# EAGLE schematic blink1mk3_card2 (EAGLE 9.0.1)
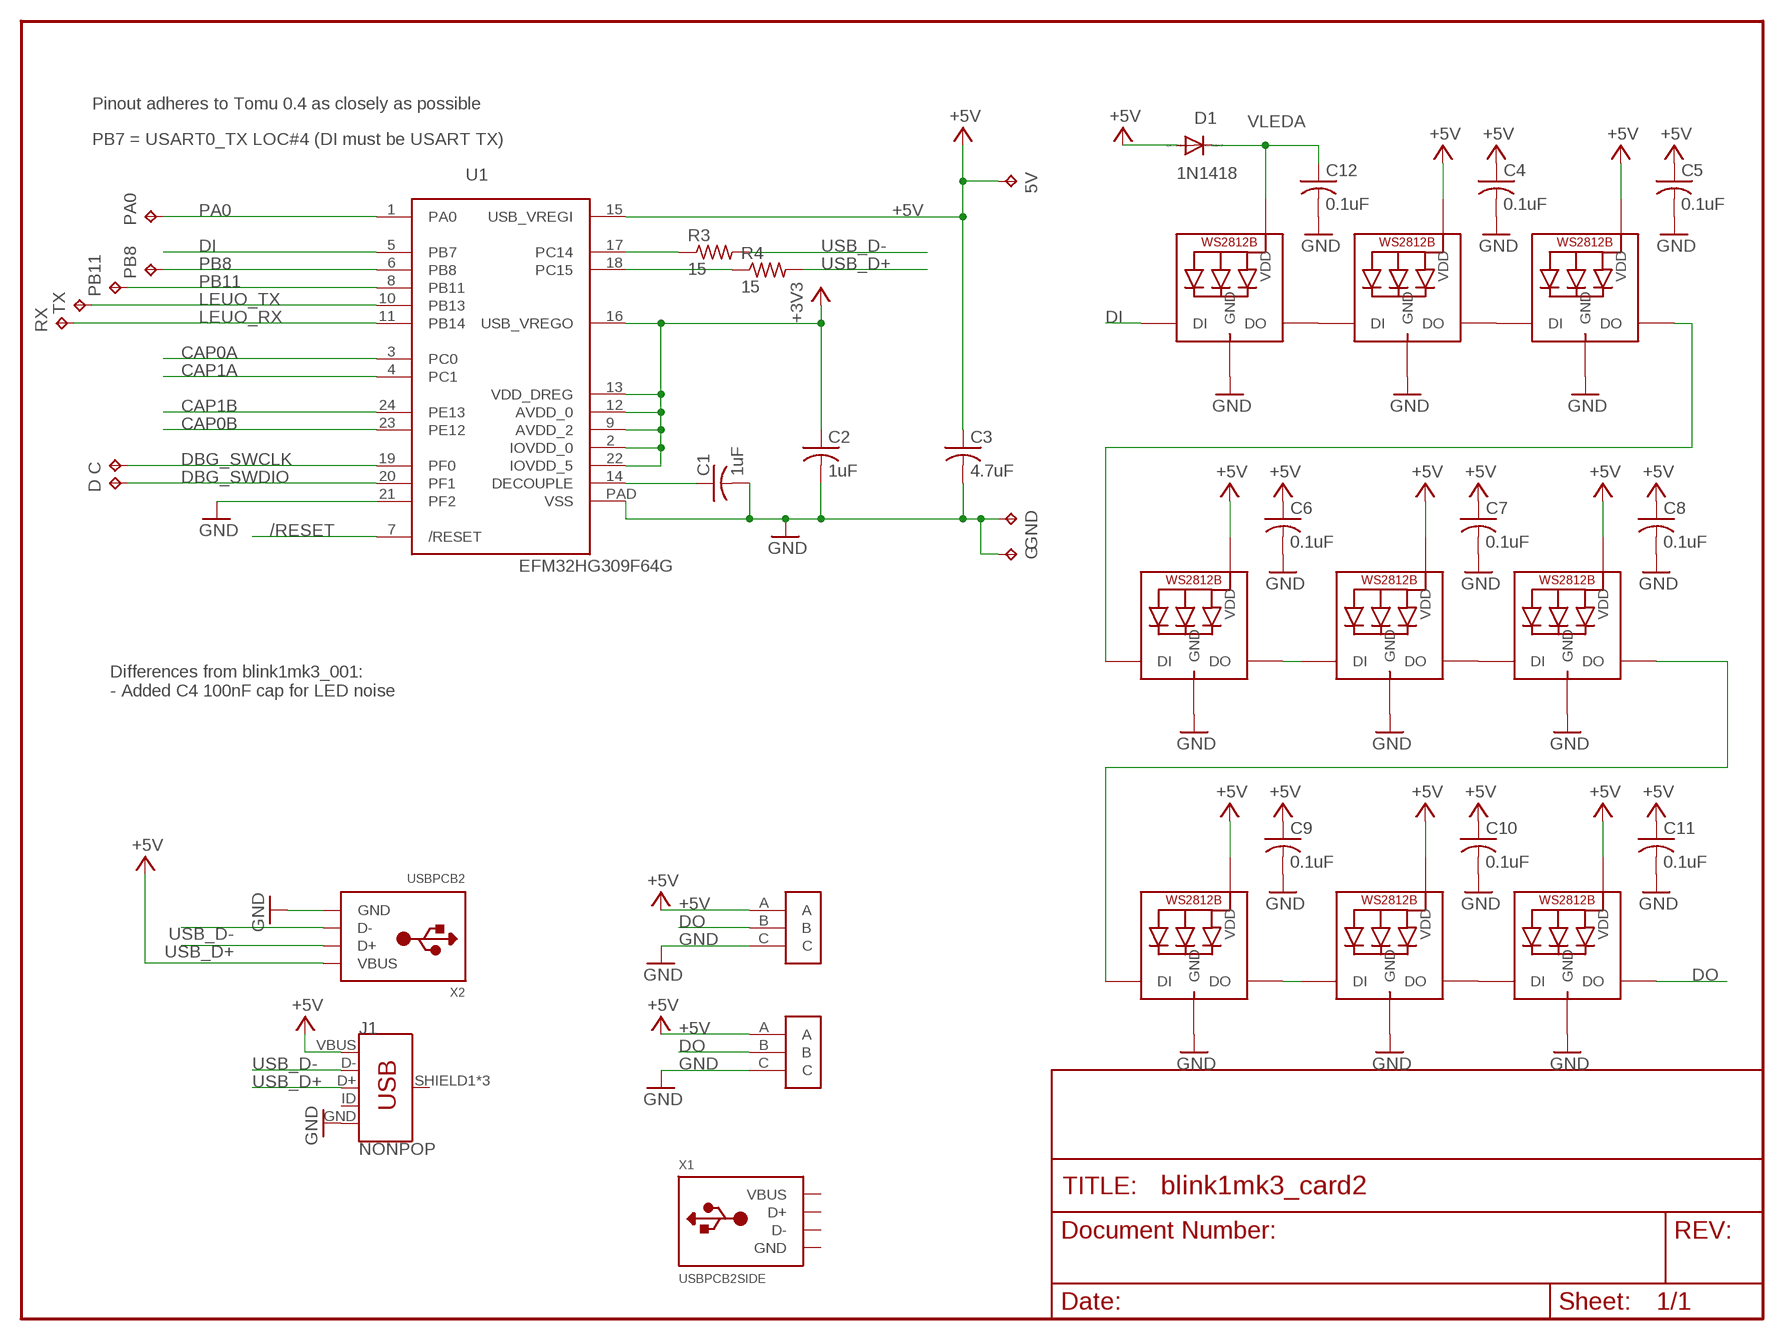
[diagram p0: schematic, sheet 1]

## Parts
5V  TPTP15R  [TP15R]
C  TPTP15R  [TP15R]
C1  1uF  C-USC0603  [C0603]
C2  1uF  C-USC0603  [C0603]
C3  4.7uF  C-USC0603  [C0603]
C4  0.1uF  C-USC0603  [C0603]
C5  0.1uF  C-USC0603  [C0603]
C6  0.1uF  C-USC0603  [C0603]
C7  0.1uF  C-USC0603  [C0603]
C8  0.1uF  C-USC0603  [C0603]
C9  0.1uF  C-USC0603  [C0603]
C10  0.1uF  C-USC0603  [C0603]
C11  0.1uF  C-USC0603  [C0603]
C12  0.1uF  C-USC0603  [C0603]
D  TPTP15R  [TP15R]
D1  1N1418  DIODE-SOD523  [SOD523]
G  TPTP14SQ  [TP14SQ]
GND  TPTP14SQ  [TP14SQ]
J1  NONPOP  USB_MICRO-B_FEMALE-SMT  [USB-B-MICRO-SMD]
LED1  SK6812MINI  WS2812B3535  [LED3535]
LED2  SK6812MINI  WS2812B3535  [LED3535]
LED3  SK6812MINI  WS2812B3535  [LED3535]
LED4  SK6812MINI  WS2812B3535  [LED3535]
LED5  SK6812MINI  WS2812B3535  [LED3535]
LED6  SK6812MINI  WS2812B3535  [LED3535]
LED7  SK6812MINI  WS2812B3535  [LED3535]
LED8  SK6812MINI  WS2812B3535  [LED3535]
LED9  SK6812MINI  WS2812B3535  [LED3535]
PA0  TPTP15R  [TP15R]
PB8  TPTP15R  [TP15R]
PB11  TPTP15R  [TP15R]
R3  15  R-US_R0603  [R0603]
R4  15  R-US_R0603  [R0603]
RX  TPTP15R  [TP15R]
TX  TPTP15R  [TP15R]
U1  EFM32HG309F64G  [QFN24PAD]
U$1  LED_STRIP_3P  [LEDSTRIP-3P]
U$2  LED_STRIP_3P  [LEDSTRIP-3P]
X1  USBPCB2SIDE  [USB-A-PCB-TWOSIDED]
X2  USBPCB2  [USB-A-PCB-2]

## Nets
+3V3: C2.1 U1.2(IOVDD_0) U1.9(AVDD_2) U1.12(AVDD_0) U1.13(VDD_DREG) U1.16(USB_VREGO) U1.22(IOVDD_5)
+5V: 5V.TP C3.1 C4.1 C5.1 C6.1 C7.1 C8.1 C9.1 C10.1 C11.1 D1.A J1.VBUS LED2.2(VDD) LED3.2(VDD) LED4.2(VDD) LED5.2(VDD) LED6.2(VDD) LED7.2(VDD) LED8.2(VDD) LED9.2(VDD) U1.15(USB_VREGI) U$1.A U$2.A X2.5V(VBUS)
/RESET: U1.7(/RESET)
CAP0A: U1.3(PC0)
CAP0B: U1.23(PE12)
CAP1A: U1.4(PC1)
CAP1B: U1.24(PE13)
DBG_SWCLK: C.TP U1.19(PF0)
DBG_SWDIO: D.TP U1.20(PF1)
DECOUPLE: C1.1 U1.14(DECOUPLE)
DI: LED1.1(DI) U1.5(PB7)
DO: LED9.3(DO) U$1.B U$2.B
GND: C1.2 C2.2 C3.2 C4.2 C5.2 C6.2 C7.2 C8.2 C9.2 C10.2 C11.2 C12.2 G.TP GND.TP J1.GND LED1.4(GND) LED2.4(GND) LED3.4(GND) LED4.4(GND) LED5.4(GND) LED6.4(GND) LED7.4(GND) LED8.4(GND) LED9.4(GND) U1.21(PF2) U1.PAD(VSS) U$1.C U$2.C X2.GND
LEUO_RX: RX.TP U1.11(PB14)
LEUO_TX: TX.TP U1.10(PB13)
N$2: LED1.3(DO) LED2.1(DI)
N$4: LED7.3(DO) LED8.1(DI)
N$5: LED4.3(DO) LED5.1(DI)
N$6: LED5.3(DO) LED6.1(DI)
N$7: LED2.3(DO) LED3.1(DI)
N$8: LED3.3(DO) LED4.1(DI)
N$9: LED8.3(DO) LED9.1(DI)
N$10: LED6.3(DO) LED7.1(DI)
PA0: PA0.TP U1.1(PA0)
PB8: PB8.TP U1.6(PB8)
PB11: PB11.TP U1.8(PB11)
RUSB_D+: R4.1 U1.18(PC15)
RUSB_D-: R3.1 U1.17(PC14)
USB_D+: J1.D+ R4.2 X2.USB_P(D+)
USB_D-: J1.D- R3.2 X2.USB_M(D-)
VLEDA: C12.1 D1.C LED1.2(VDD)
Unconnected: J1.ID J1.SHIELD1(SHIELD) J1.SHIELD2(SHIELD) J1.SHIELD3(SHIELD) X1.USB_M@1(D-) X1.USB_M@2(D-) X1.USB_M@3(D-) X1.USB_P@1(D+) X1.USB_P@2(D+) X1.USB_P@3(D+)

## Notes on the sheet
- Pinout adheres to Tomu 0.4 as closely as possible
- PB7 = USART0_TX LOC#4 (DI must be USART TX)
- Differences from blink1mk3_001:
  - Added C4 100nF cap for LED noise

## Power pins joined to a net without a drawn wire
GND: X1.GND@1(GND) X1.GND@2(GND) X1.GND@3(GND)
VBUS: X1.5V@1(VBUS) X1.5V@2(VBUS) X1.5V@3(VBUS)

## Library data of the parts
5V C D G GND PA0 PB8 PB11 RX TX = testpad:TP: Test pad
C1-C12 = adafruit:C-US: CAPACITOR, American symbol
D1 = diode:DIODE-: DIODE
J1 = SparkFun-Connectors:USB_MICRO-B: USB Type Micro-B Connector Male/female and PTH/SMT variants SparkFun Products: SparkFun microB USB Breakout <https://www.sparkfun.com/products/12035> SparkFun USB microB Plug Breakout <https://www.sparkfun.com/products/10031> SparkFun ESP8266 Thing <https://www.sparkfun.com/products/13231>; PROD_ID: CONN-11752
LED1-LED9 = adafruit:WS2812B
R3 R4 = adafruit:R-US_: RESISTOR, American symbol
U1 = todstuff:EFM32HG309F64G
U$1 U$2 = NeoJoints:LED_STRIP_3P: NeoJoint pads for WS2812 / NeoPixel LED strips
X1 X2 = todstuff:USB